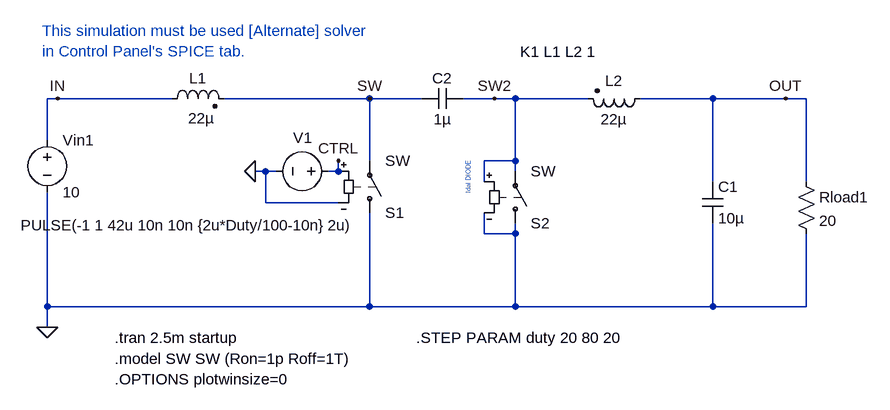
[diagram p0: schematic Fig_7-32_CUK_Ideal_Duty.asc]
Fig_7-32_CUK_Ideal_Duty.asc, the LTspice schematic file:
Version 4
SHEET 1 880 680
WIRE -992 -448 -1008 -448
WIRE -816 -448 -992 -448
WIRE -512 -448 -736 -448
WIRE -432 -448 -512 -448
WIRE -320 -448 -368 -448
WIRE -288 -448 -320 -448
WIRE -176 -448 -288 -448
WIRE 16 -448 -96 -448
WIRE 128 -448 16 -448
WIRE 160 -448 128 -448
WIRE -1008 -384 -1008 -448
WIRE -512 -352 -512 -448
WIRE -288 -352 -288 -448
WIRE -288 -352 -336 -352
WIRE -672 -336 -688 -336
WIRE -656 -336 -672 -336
WIRE -560 -336 -560 -352
WIRE -560 -336 -576 -336
WIRE -288 -336 -288 -352
WIRE -336 -320 -336 -352
WIRE 16 -320 16 -448
WIRE 160 -320 160 -448
WIRE -672 -288 -672 -336
WIRE -560 -288 -672 -288
WIRE -336 -240 -336 -272
WIRE -288 -240 -288 -256
WIRE -288 -240 -336 -240
WIRE -1008 -128 -1008 -304
WIRE -512 -128 -512 -272
WIRE -512 -128 -1008 -128
WIRE -288 -128 -288 -240
WIRE -288 -128 -512 -128
WIRE 16 -128 16 -256
WIRE 16 -128 -288 -128
WIRE 160 -128 160 -240
WIRE 160 -128 16 -128
WIRE -1008 -96 -1008 -128
FLAG -1008 -96 0
FLAG 128 -448 OUT
FLAG -992 -448 IN
FLAG -512 -448 SW
FLAG -560 -352 CTRL
FLAG -688 -336 0
FLAG -320 -448 SW2
SYMBOL sw -512 -256 M180
SYMATTR InstName S1
SYMBOL ind2 -832 -432 R270
WINDOW 0 32 56 VTop 2
WINDOW 3 1 61 VBottom 2
SYMATTR InstName L1
SYMATTR Value 22µ
SYMATTR Type ind
SYMATTR SpiceLine Rser=1m Rpar=1K
SYMBOL cap 0 -320 R0
SYMATTR InstName C1
SYMATTR Value 10µ
SYMBOL voltage -1008 -400 R0
WINDOW 123 0 0 Left 2
WINDOW 39 0 0 Left 2
SYMATTR InstName Vin1
SYMATTR Value 10
SYMBOL voltage -560 -336 M270
WINDOW 123 0 0 Left 2
WINDOW 39 0 0 Left 2
WINDOW 0 52 40 VRight 2
WINDOW 3 -83 -28 VRight 2
SYMATTR InstName V1
SYMATTR Value PULSE(-1 1 42u 10n 10n {2u*Duty/100-10n} 2u)
SYMBOL res 144 -336 R0
SYMATTR InstName Rload1
SYMATTR Value 20
SYMBOL sw -288 -240 M180
SYMATTR InstName S2
SYMBOL ind2 -80 -464 R90
WINDOW 0 4 56 VBottom 2
WINDOW 3 32 56 VTop 2
SYMATTR InstName L2
SYMATTR Value 22µ
SYMATTR Type ind
SYMATTR SpiceLine Rser=1m Rpar=1K
SYMBOL cap -432 -432 R270
WINDOW 0 32 32 VTop 2
WINDOW 3 0 32 VBottom 2
SYMATTR InstName C2
SYMATTR Value 1µ
TEXT -904 -48 Left 2 !.model SW SW (Ron=1p Roff=1T)
TEXT -904 -80 Left 2 !.tran 2.5m startup
TEXT -440 -80 Left 2 !.STEP PARAM duty 20 80 20
TEXT -360 -352 VRight 0 ;Idal DIODE
TEXT -904 -16 Left 2 !.OPTIONS plotwinsize=0
TEXT -280 -520 Left 2 !K1 L1 L2 1
TEXT -1016 -552 Left 2 ;This simulation must be used [Alternate] solver\nin Control Panel's SPICE tab.

The netlist it stands for:
* Fig_7-32_CUK_Ideal_Duty.asc
S1 0 SW CTRL 0 SW
L1 IN SW 22µ Rser=1m Rpar=1K
C1 OUT 0 10µ
Vin1 IN 0 10
V1 CTRL 0 PULSE(-1 1 42u 10n 10n {2u*Duty/100-10n} 2u)
Rload1 OUT 0 20
S2 0 SW2 SW2 0 SW
L2 OUT SW2 22µ Rser=1m Rpar=1K
C2 SW SW2 1µ
.model SW SW (Ron=1p Roff=1T)
.tran 2.5m startup
.STEP PARAM duty 20 80 20
* Idal DIODE
.OPTIONS plotwinsize=0
K1 L1 L2 1
* This simulation must be used [Alternate] solver
* in Control Panel's SPICE tab.
.backanno
.end